# Altium project STM32F103.PrjPcb
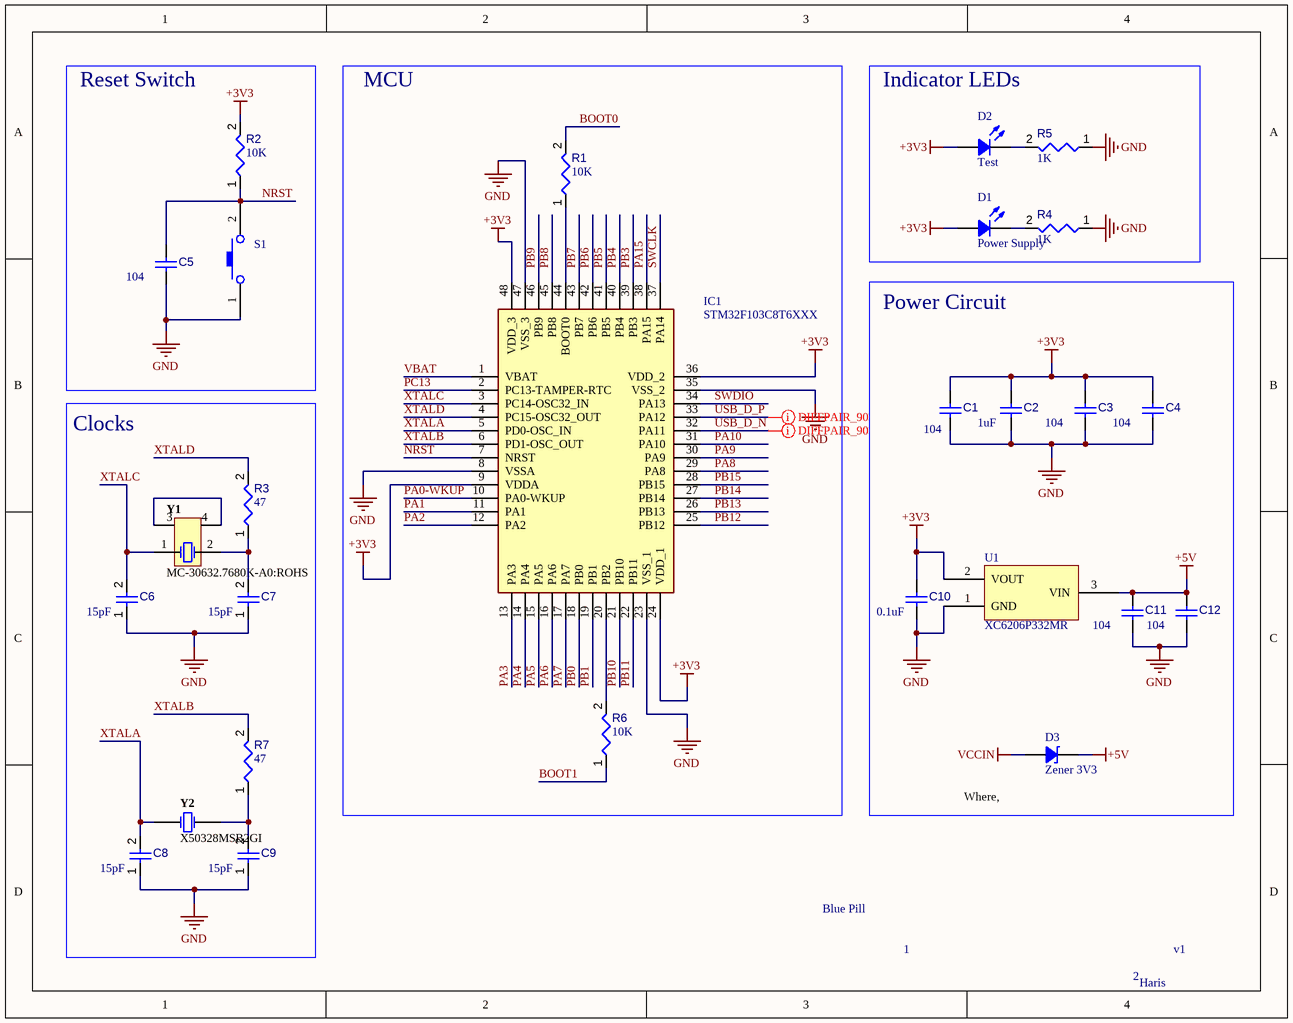
[diagram p0: Controller_page.SchDoc]
2 sheets, 33 parts. Net scope: global (net labels, ports and power ports of the same name join across sheets).
Board file: STM32F103_Blue_Pill.PcbDoc
Sheets:
  Controller_page.SchDoc
  Connector_page.SchDoc

## Sheet Controller_page.SchDoc: Blue Pill
size A; DrawnBy: Haris; Engineer: Haris; Revision: v1; SheetNumber: 1; SheetTotal: 2

### Parts
C1  value 104  [CAPC0805(2012)145_L]  (hidden comment: Capacitor 4.7µF +/-40% 25V 0805)
C2  value 1uF  [CAPC0805(2012)145_L]  (hidden comment: Capacitor 4.7µF +/-40% 25V 0805)
C3  value 104  [CAPC0805(2012)145_L]  (hidden comment: Capacitor 4.7µF +/-40% 25V 0805)
C4  value 104  [CAPC0805(2012)145_L]  (hidden comment: Capacitor 4.7µF +/-40% 25V 0805)
C5  value 104  [CAPC0805(2012)145_L]  (hidden comment: Capacitor 4.7µF +/-40% 25V 0805)
C6  value 15pF  [CAPC0805(2012)145_L]  (hidden comment: Capacitor 4.7µF +/-40% 25V 0805)
C7  value 15pF  [CAPC0805(2012)145_L]  (hidden comment: Capacitor 4.7µF +/-40% 25V 0805)
C8  value 15pF  [CAPC0805(2012)145_L]  (hidden comment: Capacitor 4.7µF +/-40% 25V 0805)
C9  value 15pF  [CAPC0805(2012)145_L]  (hidden comment: Capacitor 4.7µF +/-40% 25V 0805)
C10  value 0.1uF  [CAPC0805(2012)145_L]  (hidden comment: Capacitor 4.7µF +/-40% 25V 0805)
C11  value 104  [CAPC0805(2012)145_L]  (hidden comment: Capacitor 4.7µF +/-40% 25V 0805)
C12  value 104  [CAPC0805(2012)145_L]  (hidden comment: Capacitor 4.7µF +/-40% 25V 0805)
D1  Power Supply  [LED 0805_2012 GREEN]
D2  Test  [LED 0805_2012 RED]
D3  Zener 3V3  [SOD-123]
IC1  STM32F103C8T6XXX  [QFP50P900X900X160-48N]
R1  value 10K  [RESC0805(2012)_L]  (hidden comment: 470R5J)
R2  value 10K  [RESC0805(2012)_L]  (hidden comment: 470R5J)
R3  value 47  [RESC0805(2012)_L]  (hidden comment: 470R5J)
R4  value 1K  [RESC0805(2012)_L]  (hidden comment: 470R5J)
R5  value 1K  [RESC0805(2012)_L]  (hidden comment: 470R5J)
R6  value 10K  [RESC0805(2012)_L]  (hidden comment: 470R5J)
R7  value 47  [RESC0805(2012)_L]  (hidden comment: 470R5J)
S1  TS-1088-AR02016  [TS-1088-AR02016-Footprint-1]  (value not drawn)
U1  XC6206P332MR  [XC6206P332MR-Footprint-1]
Y1  MC-30632.7680K-A0:ROHS  [MC-30632.7680K-A0:ROHS-Footprint-1]
Y2  X50328MSB2GI  [X50328MSB2GI-Footprint-1]

### Blocks framed on the sheet
Reset Switch: C5 R2 S1
MCU: IC1 R1 R6
Indicator LEDs: D1 D2 R4 R5
Power Circuit: C1-C4 C10-C12 D3 U1
Clocks: C6-C9 R3 R7 Y1 Y2

### Nets
+3V3: C1.2 C2.2 C3.2 C4.2 C10.2 D1.1 D2.1 IC1.9(VDDA) IC1.24(VDD_1) IC1.36(VDD_2) IC1.48(VDD_3) R2.2 U1.2(VOUT)
+5V: C11.2 C12.2 D3.2 U1.3(VIN)
GND: C1.1 C2.1 C3.1 C4.1 C5.1 C6.1 C7.1 C8.1 C9.1 C10.1 C11.1 C12.1 IC1.8(VSSA) IC1.23(VSS_1) IC1.35(VSS_2) IC1.47(VSS_3) R4.1 R5.1 S1.1 U1.1(GND)
VCCIN: D3.1
BOOT0: R1.2
BOOT1: R6.1
NRST: C5.2 IC1.7(NRST) R2.1 S1.2
PA0-WKUP: IC1.10(PA0-WKUP)
PA1: IC1.11(PA1)
PA2: IC1.12(PA2)
PA3: IC1.13(PA3)
PA4: IC1.14(PA4)
PA5: IC1.15(PA5)
PA6: IC1.16(PA6)
PA7: IC1.17(PA7)
PA8: IC1.29(PA8)
PA9: IC1.30(PA9)
PA10: IC1.31(PA10)
PA15: IC1.38(PA15)
PB0: IC1.18(PB0)
PB1: IC1.19(PB1)
PB3: IC1.39(PB3)
PB4: IC1.40(PB4)
PB5: IC1.41(PB5)
PB6: IC1.42(PB6)
PB7: IC1.43(PB7)
PB8: IC1.45(PB8)
PB9: IC1.46(PB9)
PB10: IC1.21(PB10)
PB11: IC1.22(PB11)
PB12: IC1.25(PB12)
PB13: IC1.26(PB13)
PB14: IC1.27(PB14)
PB15: IC1.28(PB15)
PC13: IC1.2(PC13-TAMPER-RTC)
SWCLK: IC1.37(PA14)
SWDIO: IC1.34(PA13)
USB_D_N: IC1.32(PA11)
USB_D_P: IC1.33(PA12)
VBAT: IC1.1(VBAT)
XTALA: C8.2 IC1.5(PD0-OSC_IN) Y2.1
XTALB: IC1.6(PD1-OSC_OUT) R7.2
XTALC: C6.2 IC1.3(PC14-OSC32_IN) Y1.1
XTALD: IC1.4(PC15-OSC32_OUT) R3.2
NetC7_2: C7.2 R3.1 Y1.2
NetC9_2: C9.2 R7.1 Y2.2
NetD1_2: D1.2 R4.2
NetD2_2: D2.2 R5.2
NetIC1_20: IC1.20(PB2) R6.2
NetIC1_44: IC1.44(BOOT0) R1.1

Not connected (* = marked no-connect by the designer): Y1 3 4

### Layout directives
differential pair; differential pair class diff_90: USB_D_N, USB_D_P

### Notes on the sheet
- (near D3) Where, @{"Id":"IHHNLVRZ\HNVIZJBW","ObjectType":1} is from the USB.

### Library data of the parts
C1-C5 C10-C12 = CMP-001-00080-4: Chip Capacitor, 4.7µF +/-40%, 25V, 0805, Thickness 1.45 mm; Tolerance: 20%; Voltage Rating: 25V; Min Operating Temperature: -55°C; Max Operating Temperature: 85°C; Pins: 2; Mounting Technology: SMT; Case/Package: 0805
C6-C9 = CMP-001-00080-5: Chip Capacitor, 4.7µF +/-40%, 25V, 0805, Thickness 1.45 mm; Tolerance: 20%; Voltage Rating: 25V; Min Operating Temperature: -55°C; Max Operating Temperature: 85°C; Pins: 2; Mounting Technology: SMT; Case/Package: 0805
D1 = APHCM2012CGCK-F01: LED GREEN CLEAR CHIP SMD; Manufacturer: Kingbright; Configuration: Standard; Current - Test: 20mA; Lens Color: Colorless; Lens Size: 1.30mm x 1.25mm; Lens Style: Rectangle with Flat Top; Millicandela Rating: 50mcd; Viewing Angle: 110°; Voltage - Forward (Vf) (Typ): 2.1V; Wavelength - Dominant: 570nm; Wavelength - Peak: 574nm; Part Number: APHCM2012CGCK-F01; Color: Green; ComponentLink1Description: Datasheet; ComponentLink1URL: http://www.kingbrightusa.com/images/catalog/SPEC/APHCM2012CGCK-F01.pdf; ComponentLink2Description: DigiKey Link; ComponentLink2URL: https://www.digikey.com/en/products/detail/kingbright/APHCM2012CGCK-F01/1747492; Device Package: 0805 (2012 Metric); Height (Max): 0.40mm; LastUpdated: 3/11/2024 7:52:47 AM; Lens Transparency: Clear; Lifecycle Status: Active; Minimum Order: 1; Mounting Type: Surface Mount; Package / Case: 0805 (2012 Metric); Packaging: TapeAndReel; PartId: 241; Part Status: Active; Price: 0.05; Series: -; Size / Dimension: 2.00mm L x 1.25mm W; Supplier 1: DigiKey; Supplier Part Number 1: 754-1094-1-ND; Supplier Device Package: Chip LED; Value: Green
D2 = LTST-C170KAKT: LED RED CLEAR SMD; Manufacturer: Lite-On Inc.; Configuration: Standard; Current - Test: 20mA; Lens Color: Colorless; Lens Size: 1.40mm x 1.25mm; Lens Style: Rectangle with Flat Top; Millicandela Rating: 54mcd; Viewing Angle: 130°; Voltage - Forward (Vf) (Typ): 2V; Wavelength - Dominant: 615nm; Wavelength - Peak: 621nm; Part Number: LTST-C170KAKT; Color: Red; ComponentLink1Description: Datasheet; ComponentLink1URL: http://optoelectronics.liteon.com/upload/download/DS-22-99-0182/LTST-C170KAKT.pdf; ComponentLink2Description: DigiKey Link; ComponentLink2URL: http://digikey.com/product-detail/en/lite-on-inc/LTST-C170KAKT/160-1412-1-ND/386772; Device Package: 0805 (2012 Metric); Height (Max): 1.10mm; LastUpdated: 3/11/2024 7:52:22 AM; Lens Transparency: Clear; Lifecycle Status: Active; Minimum Order: 1; Mounting Type: Surface Mount; Package / Case: 0805 (2012 Metric); Packaging: TapeAndReel; PartId: 305; Part Status: Active; Price: 0.07; Series: -; Size / Dimension: 2.00mm L x 1.25mm W; Supplier 1: DigiKey; Supplier Part Number 1: 160-1412-1-ND; Value: Red
D3 = BZT52C3V3-HE3-18: DIODE ZENER 3.3V 410MW SOD123; Manufacturer: Vishay Semiconductor Diodes Division; Impedance (Max) (Zzt): 80 Ohms; Tolerance: ±5%; Part Number: BZT52C3V3-HE3-18; ComponentLink1Description: Datasheet; ComponentLink1URL: http://www.vishay.com/docs/85760/bzt52.pdf; ComponentLink2Description: DigiKey Link; ComponentLink2URL: http://digikey.com/product-detail/en/vishay-semiconductor-diodes-division/BZT52C3V3-HE3-18/BZT52C3V3-HE3-18GICT-ND/7717359; LastUpdated: 3/11/2024 7:47:45 AM; Lifecycle Status: Active; Minimum Order: 1; Mounting Type: Surface Mount; Operating Temperature: -55°C ~ 150°C; Package / Case: SOD-123; Packaging: TapeAndReel; PartId: 1614; Part Status: Active; Power - Max: 410mW; Price: 0.04; Series: Automotive, AEC-Q101; Supplier 1: DigiKey; Supplier Part Number 1: BZT52C3V3-HE3-18GICT-ND; Supplier Device Package: SOD-123; Voltage - Zener (Nom) (Vz): 3.3V
IC1 = STM32F103C8T6XXX: Integrated Circuit; Manufacturer_Name: ST; Height: 1.6mm; Manufacturer_Part_Number: STM32F103C8T6XXX
R1 R2 R4-R6 = CMP-009-00102-2: 470R 0.125W 5% 0805 (2012 Metric)  SMD; Power: 125mW; Pins: 2; Case/Package: 0805; Mounting Technology: SMT; Tolerance: 5%
R3 R7 = CMP-009-00102-3: 470R 0.125W 5% 0805 (2012 Metric)  SMD; Power: 125mW; Pins: 2; Case/Package: 0805; Mounting Technology: SMT; Tolerance: 5%
S1 = CMP-011-00069-3: NO 50mA 100MΩ 100000 Times 12V 160gf@±50gf Brick nogging SPST SMD Tactile Switches ROHS; Pins: 2; Current Rating: 50mA; Case/Package: SMD; Voltage Rating: 12V; RoHS Compliant: Yes; Throw Configuration: SPST
U1 = CMP-019-00049-3: 200mA Fixed 3.3V Positive 6V SOT-23-3L Linear Voltage Regulators (LDO) ROHS; Dropout Voltage: 680mV; Pins: 3; Output Current: 200mA; Output Voltage: 3.3V; Case/Package: SOT-23-3L
Y1 = CMP-003-00031-7: 32.768 kHz ±20ppm Crystal 12.5pF 50 kOhms 4-SOJ, 5.50mm pitch; ESR: 50k; Min Operating Temperature: -40°C; Load Capacitance: 12.5pF; Frequency: 32.768kHz; Case/Package: 4-SOJ 5.50mm pitch; Max Operating Temperature: 85°C; Mounting Technology: PARALLEL - FUNDAMENTAL; RoHS Compliant: Yes; Pins: 4
Y2 = CMP-003-00032-3: 8MHz 20pF ±10ppm SMD5032-2P Crystals ROHS; ESR: 80; Min Operating Temperature: -40°C; RoHS Compliant: Yes; Max Operating Temperature: 125°C; Frequency: 8MHz; Load Capacitance: 20pF; Mounting Technology: SMD; Pins: 2; Case/Package: SMD5032-2P

## Sheet Connector_page.SchDoc
size A; SheetNumber: 2; SheetTotal: 2
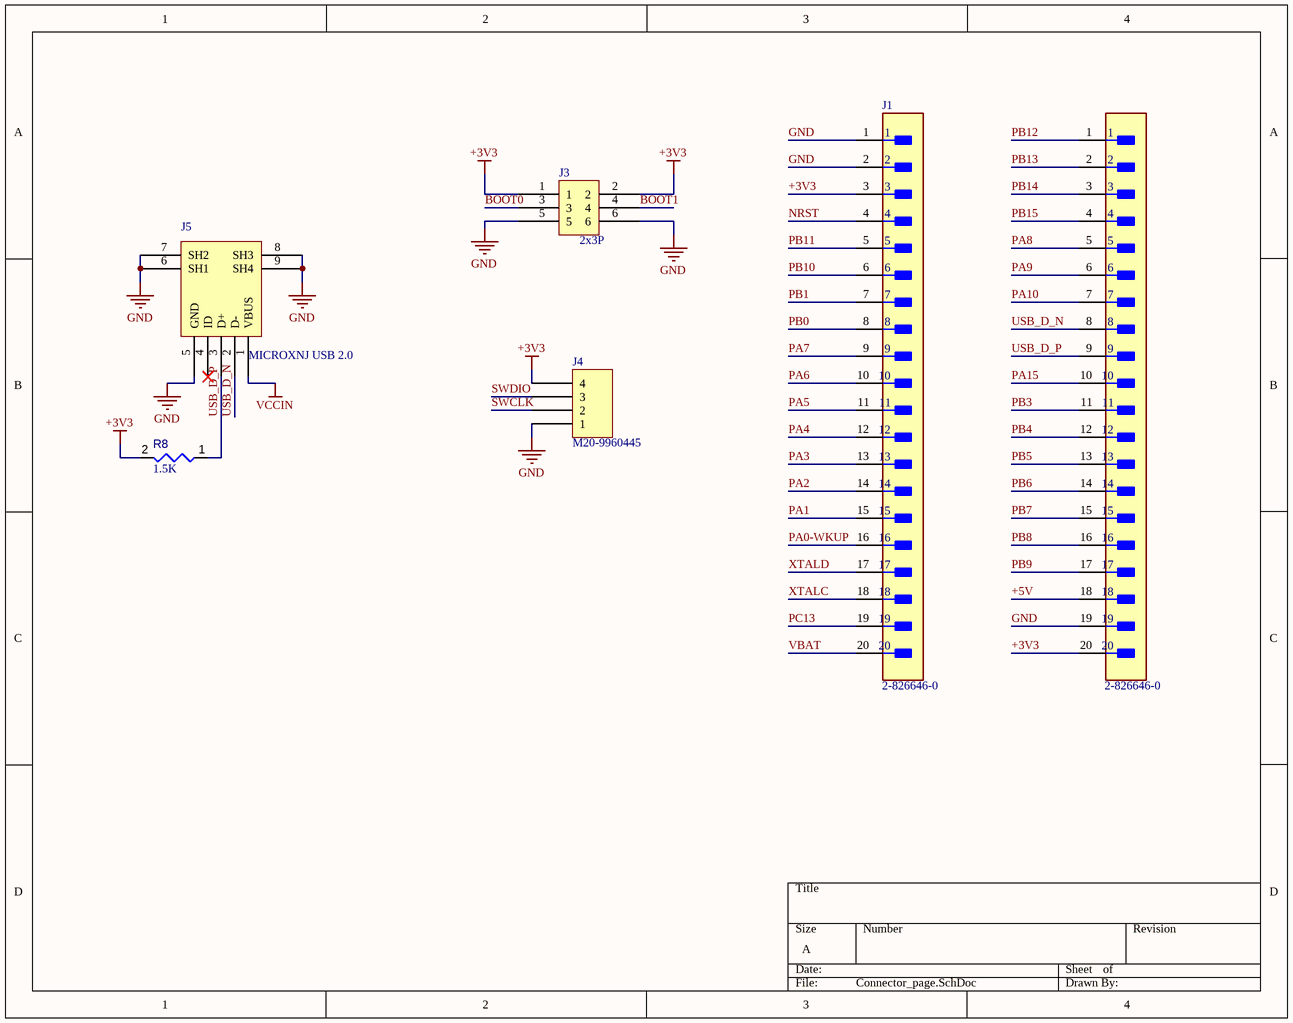
[diagram p1: Connector_page.SchDoc]

### Parts
J1  2-826646-0  [FP-2-826646-0-MFG]
J3  2x3P  [2x3P 2.54mm Pin Header -Footprint-1]
J4  M20-9960445  [HARWIN M20-9960445]
J5  MICROXNJ USB 2.0  [USB 2.0 Tupe B Micro]
R8  value 1.5K  [RESC0805(2012)_L]  (hidden comment: 470R5J)
  2-826646-0  [FP-2-826646-0-MFG]

### Nets
+3V3: J1.3 J3.1 J3.2 J4.4 R8.2 .20
+5V: .18
GND: J1.1 J1.2 J3.5 J3.6 J4.1 J5.5(GND) J5.6(SH1) J5.7(SH2) J5.8(SH3) J5.9(SH4) .19
VCCIN: J5.1(VBUS)
BOOT0: J3.3
BOOT1: J3.4
NRST: J1.4
PA0-WKUP: J1.16
PA1: J1.15
PA2: J1.14
PA3: J1.13
PA4: J1.12
PA5: J1.11
PA6: J1.10
PA7: J1.9
PA8: .5
PA9: .6
PA10: .7
PA15: .10
PB0: J1.8
PB1: J1.7
PB3: .11
PB4: .12
PB5: .13
PB6: .14
PB7: .15
PB8: .16
PB9: .17
PB10: J1.6
PB11: J1.5
PB12: .1
PB13: .2
PB14: .3
PB15: .4
PC13: J1.19
SWCLK: J4.2
SWDIO: J4.3
USB_D_N: J5.2(D-) .8
USB_D_P: J5.3(D+) R8.1 .9
VBAT: J1.20
XTALC: J1.18
XTALD: J1.17

Not connected (* = marked no-connect by the designer): J5 4(ID)*

### Library data of the parts
J1  = CMP-03369-000139-1: CONN HEADER VERT 20POS 2.54MM; Mating Connector Lock: No (Without); High Temperature Housing: No; Current Rating: 3A; Number of Positions: 20; PCB Mounting Orientation: Vertical; Connector Type: Plug; PCB Mount Retention: Without; Plating Thickness: 0.8um; Contact Post Length: 0.1259inch; Selectively Loaded: No (Without); Series: AMPMODU MOD II; Number of Rows: 1; Housing Color: Green; Mount: Straddle Mount; Max Operating Temperature: 105°C; Packaging: Carton; Row Spacing: 2.54mm; Board Standoff: No (Without); RoHS Compliant: Yes; Orientation: Straight; Contact Protection: No (Without); Strain Relief: No (Without); Keyed: No; Radiation Hardening: No; Package Quantity: 300; Contact Mating Length: 5.8mm; Termination: Through Hole; Contact Shape: Square; Length: 50.8mm; Pitch: 2.54mm; Stabilizers: No (Without); Gasket: No (Without); Number of Contacts: 20; Contact Gender: Male; Mating Alignment: No (Without); Min Operating Temperature: -65°C; Contact Type: Male Pin; Contact Plating: Gold; Flammability Rating: UL94 V-0; Housing Material: PBT; Color: Green; High Speed Serial Data Connector: No; Depth: 2.5mm; ELV: Compliant; Contact Material: Bronze
J3 = CMP-002-00390-1: PZ254-2-03-Z-8.5; Gender: Male; Max Current Rating: 3A; Connector Type: Pin Header; RoHS Compliant: Yes; Mounting Technology: TH; Pins: 6; Case/Package: Plugin, P=2.54mm
J4 = M20-9960445: CONN HEADER R/A 4POS 2.54MM; Manufacturer: Harwin Inc.; Connector Type: Header, Cuttable; Contact Length - Mating: 0.240" (6.10mm); Contact Length - Post: 0.118" (3.00mm); Current Rating (Amps): 3A per Contact; Material Flammability Rating: UL94 V-0; Number of Positions: 4; Number of Positions Loaded: All; Pitch - Mating: 0.100" (2.54mm); Row Spacing - Mating: -40°C ~ 105°C; Shrouding: Unshrouded; Style: Board to Board or Cable; Part Number: M20-9960445; ComponentLink1Description: Datasheet; ComponentLink1URL: https://cdn.harwin.com/pdfs/Harwin_PC_Connectors_M20.pdf; ComponentLink2Description: DigiKey Link; ComponentLink2URL: https://www.digikey.com/en/products/detail/harwin-inc/M20-9960445/3921052; Contact Finish - Mating: Gold; Contact Material: Brass; Contact Shape: Square; Contact Type: Male Pin; Fastening Type: Push-Pull; Insulation Color: Black; Insulation Height: 0.100" (2.54mm); Insulation Material: Polyamide (PA6T), Nylon 6T; LastUpdated: 9/21/2022 7:23:20 PM; Lifecycle Status: Active; Minimum Order: 1; Mounting Type: Through Hole, Right Angle; Number of Rows: 1; Operating Temperature: -40°C ~ 105°C; Packaging: Bulk; PartId: 167; Part Status: Active; Price: 0.11; Series: M20; Supplier 1: DigiKey; Supplier Part Number 1: 952-3286-ND; Termination: Solder
J5 = CMP-002-00071-9: 1A USB 2.0 1 Surface Mount 5P Female -20℃~+85℃ Micro-B SMD USB Connectors ROHS; Pins: 9; Min Operating Temperature: -25°C; Gender: Female; RoHS Compliant: Yes; Mounting Technology: SMD; Max Current Rating: 1A; Max Operating Temperature: 85°C; Case/Package: USB 2.0; Connector Type: Micro-B
R8 = CMP-009-00102-2: as R1 on sheet Controller_page; Pins: 2; Case/Package: 0805; Mounting Technology: SMT; Tolerance: 5%

## Nets that join several sheets
+3V3: Controller_page (13 pins), Connector_page (6 pins)
+5V: Controller_page (C11.2 C12.2 D3.2 U1.3), Connector_page (.18)
GND: Controller_page (20 pins), Connector_page (11 pins)
VCCIN: Controller_page (D3.1), Connector_page (J5.1)
BOOT0: Controller_page (R1.2), Connector_page (J3.3)
BOOT1: Controller_page (R6.1), Connector_page (J3.4)
NRST: Controller_page (C5.2 IC1.7 R2.1 S1.2), Connector_page (J1.4)
PA0-WKUP: Controller_page (IC1.10), Connector_page (J1.16)
PA1: Controller_page (IC1.11), Connector_page (J1.15)
PA2: Controller_page (IC1.12), Connector_page (J1.14)
PA3: Controller_page (IC1.13), Connector_page (J1.13)
PA4: Controller_page (IC1.14), Connector_page (J1.12)
PA5: Controller_page (IC1.15), Connector_page (J1.11)
PA6: Controller_page (IC1.16), Connector_page (J1.10)
PA7: Controller_page (IC1.17), Connector_page (J1.9)
PA8: Controller_page (IC1.29), Connector_page (.5)
PA9: Controller_page (IC1.30), Connector_page (.6)
PA10: Controller_page (IC1.31), Connector_page (.7)
PA15: Controller_page (IC1.38), Connector_page (.10)
PB0: Controller_page (IC1.18), Connector_page (J1.8)
PB1: Controller_page (IC1.19), Connector_page (J1.7)
PB3: Controller_page (IC1.39), Connector_page (.11)
PB4: Controller_page (IC1.40), Connector_page (.12)
PB5: Controller_page (IC1.41), Connector_page (.13)
PB6: Controller_page (IC1.42), Connector_page (.14)
PB7: Controller_page (IC1.43), Connector_page (.15)
PB8: Controller_page (IC1.45), Connector_page (.16)
PB9: Controller_page (IC1.46), Connector_page (.17)
PB10: Controller_page (IC1.21), Connector_page (J1.6)
PB11: Controller_page (IC1.22), Connector_page (J1.5)
PB12: Controller_page (IC1.25), Connector_page (.1)
PB13: Controller_page (IC1.26), Connector_page (.2)
PB14: Controller_page (IC1.27), Connector_page (.3)
PB15: Controller_page (IC1.28), Connector_page (.4)
PC13: Controller_page (IC1.2), Connector_page (J1.19)
SWCLK: Controller_page (IC1.37), Connector_page (J4.2)
SWDIO: Controller_page (IC1.34), Connector_page (J4.3)
USB_D_N: Controller_page (IC1.32), Connector_page (J5.2 .8)
USB_D_P: Controller_page (IC1.33), Connector_page (J5.3 R8.1 .9)
VBAT: Controller_page (IC1.1), Connector_page (J1.20)
XTALC: Controller_page (C6.2 IC1.3 Y1.1), Connector_page (J1.18)
XTALD: Controller_page (IC1.4 R3.2), Connector_page (J1.17)